# EAGLE schematic schematic (EAGLE 7.6.0)
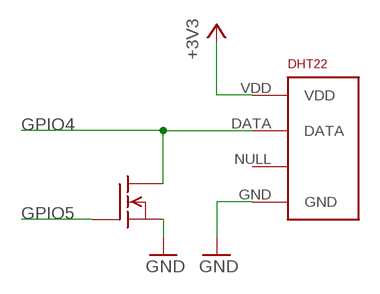
[diagram p0: schematic, sheet 1]

## Parts
DHT22  RHT03_DHT-22_AM2302  [RHT03_DHT-22]
Q1  BSS295  [TO92]

## Nets
+3V3: DHT22.VDD
GND: DHT22.GND Q1.3(S)
GPIO4: DHT22.DATA Q1.2(D)
GPIO5: Q1.1(G)
Unconnected: DHT22.NULL

## Library data of the parts
DHT22 = RHT03_DHT-22_AM2302:RHT03_DHT-22_AM2302: RHT03 / DHT-22 / AM2302 Packages and symbol for the RHT03 / DHT-22 relative humidity and temperature sensor. Note: The AM2302 is a wired version of the DHT-22 which typically requires less clearance and is thus provided as a separate package.; PROD_ID: SEN-10167
Q1 = transistor-fet:BSS295: N-Channel Enhancement MOSFET not checked